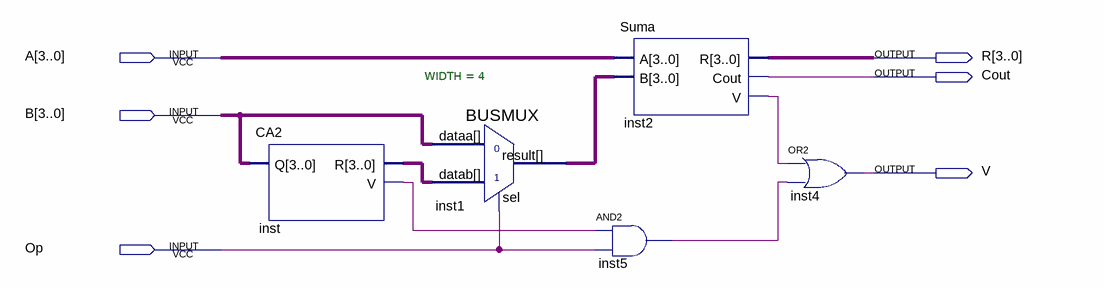
[diagram p0: schematic sheet]
// Quartus schematic SumaResta.bdf as structural Verilog: 5 symbols, 6 pins
module SumaResta (
  input  [3:0] A,
  input  [3:0] B,
  input  Op,
  output [3:0] R,
  output Cout,
  output V
);

  wire inst2_v, inst5_out, inst_v;
  wire [3:0] inst1_result, inst_r;

  CA2 inst (.Q(B), .R(inst_r), .V(inst_v));
  BUSMUX #(.WIDTH(4)) inst1 (.datab(inst_r), .sel(Op), .dataa(B), .result(inst1_result));
  Suma inst2 (.A(A), .B(inst1_result), .R(R), .Cout(Cout), .V(inst2_v));
  and inst5 (inst5_out, inst_v, Op);
  or inst4 (V, inst2_v, inst5_out);
endmodule
